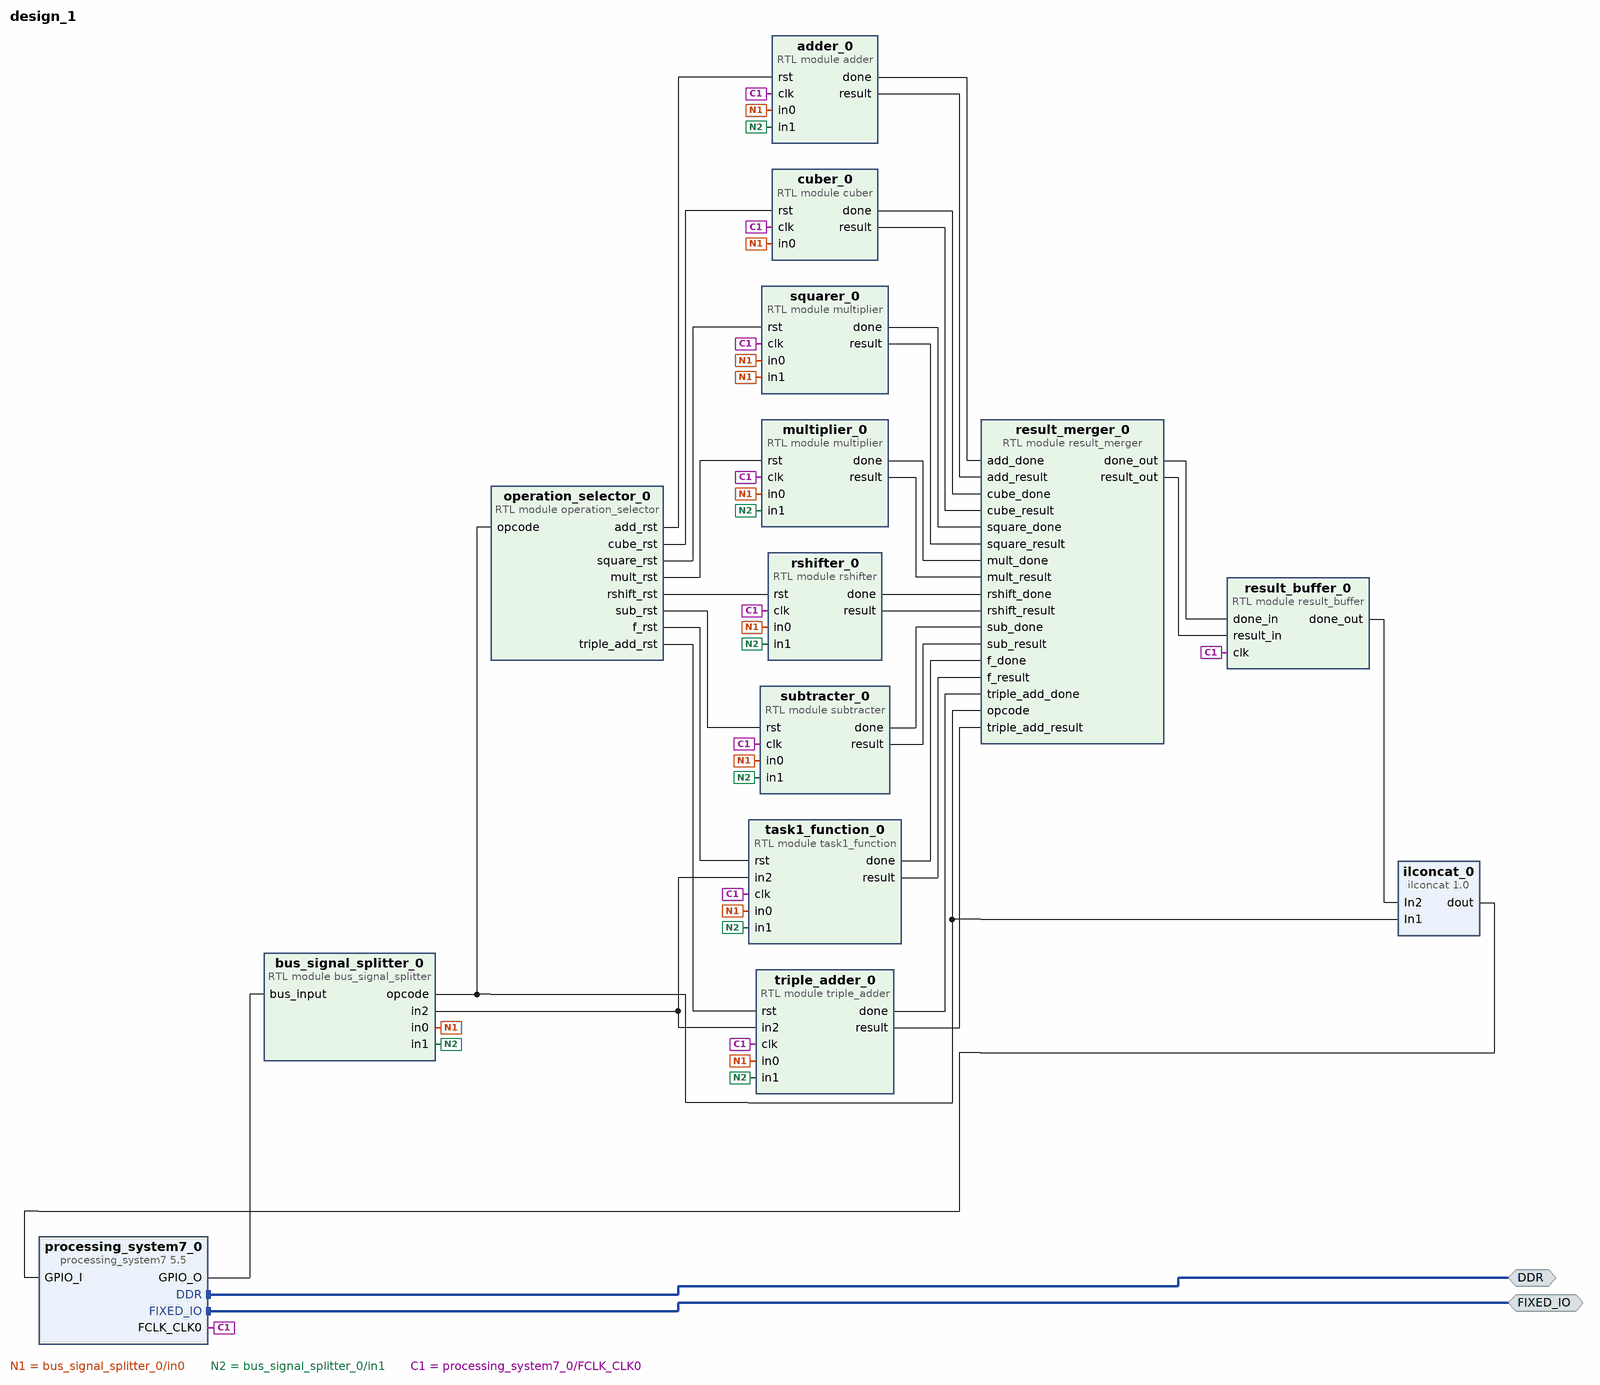
[diagram p0: block diagram of the top level]
# Vivado block design design_1, xc7z020clg400-1, Vivado 2025.2
create_bd_design design_1

create_bd_intf_port -mode Master -vlnv xilinx.com:interface:ddrx_rtl:1.0 DDR
create_bd_intf_port -mode Master -vlnv xilinx.com:display_processing_system7:fixedio_rtl:1.0 FIXED_IO

create_bd_cell -type ip -vlnv xilinx.com:ip:processing_system7:5.5 processing_system7_0
set_property -dict [list \
  CONFIG.PCW_GPIO_EMIO_GPIO_ENABLE 1 \
  CONFIG.PCW_GPIO_EMIO_GPIO_IO 52 \
  CONFIG.PCW_GPIO_EMIO_GPIO_WIDTH 52 \
  CONFIG.PCW_USE_M_AXI_GP0 0 \
] [get_bd_cells processing_system7_0]
# 2 more settings of processing_system7_0 are not shown: defaults, MIO pin electricals, DDR timing, and values the tool derives
create_bd_cell -type module -reference adder adder_0
create_bd_cell -type module -reference cuber cuber_0
create_bd_cell -type module -reference multiplier multiplier_0
create_bd_cell -type module -reference rshifter rshifter_0
create_bd_cell -type module -reference subtracter subtracter_0
create_bd_cell -type module -reference task1_function task1_function_0
create_bd_cell -type module -reference triple_adder triple_adder_0
create_bd_cell -type module -reference result_buffer result_buffer_0
create_bd_cell -type module -reference result_merger result_merger_0
create_bd_cell -type module -reference multiplier squarer_0
create_bd_cell -type inline_hdl -vlnv xilinx.com:inline_hdl:ilconcat:1.0 ilconcat_0
set_property -dict {CONFIG.IN0_WIDTH 24 CONFIG.IN1_WIDTH 24 CONFIG.NUM_PORTS 3} [get_bd_cells ilconcat_0]
create_bd_cell -type module -reference bus_signal_splitter bus_signal_splitter_0
create_bd_cell -type module -reference operation_selector operation_selector_0

# ---- connections ----

connect_bd_intf_net [get_bd_intf_ports DDR] [get_bd_intf_pins processing_system7_0/DDR]
connect_bd_intf_net [get_bd_intf_ports FIXED_IO] [get_bd_intf_pins processing_system7_0/FIXED_IO]
connect_bd_net [get_bd_pins bus_signal_splitter_0/in0] \
  [get_bd_pins squarer_0/in0] [get_bd_pins squarer_0/in1] [get_bd_pins subtracter_0/in0] [get_bd_pins multiplier_0/in0] \
  [get_bd_pins adder_0/in0] [get_bd_pins rshifter_0/in0] [get_bd_pins task1_function_0/in0] [get_bd_pins cuber_0/in0] \
  [get_bd_pins triple_adder_0/in0]
connect_bd_net [get_bd_pins adder_0/done] [get_bd_pins result_merger_0/add_done]
connect_bd_net [get_bd_pins adder_0/result] [get_bd_pins result_merger_0/add_result]
connect_bd_net [get_bd_pins bus_signal_splitter_0/in1] \
  [get_bd_pins multiplier_0/in1] [get_bd_pins subtracter_0/in1] [get_bd_pins adder_0/in1] [get_bd_pins rshifter_0/in1] \
  [get_bd_pins task1_function_0/in1] [get_bd_pins triple_adder_0/in1]
connect_bd_net [get_bd_pins bus_signal_splitter_0/in2] [get_bd_pins task1_function_0/in2] [get_bd_pins triple_adder_0/in2]
connect_bd_net [get_bd_pins bus_signal_splitter_0/opcode] \
  [get_bd_pins ilconcat_0/In1] [get_bd_pins operation_selector_0/opcode] [get_bd_pins result_merger_0/opcode]
connect_bd_net [get_bd_pins cuber_0/done] [get_bd_pins result_merger_0/cube_done]
connect_bd_net [get_bd_pins cuber_0/result] [get_bd_pins result_merger_0/cube_result]
connect_bd_net [get_bd_pins ilconcat_0/dout] [get_bd_pins processing_system7_0/GPIO_I]
connect_bd_net [get_bd_pins multiplier_0/done] [get_bd_pins result_merger_0/mult_done]
connect_bd_net [get_bd_pins multiplier_0/result] [get_bd_pins result_merger_0/mult_result]
connect_bd_net -net multiplier_1_done [get_bd_pins squarer_0/done] [get_bd_pins result_merger_0/square_done]
connect_bd_net -net multiplier_1_result [get_bd_pins squarer_0/result] [get_bd_pins result_merger_0/square_result]
connect_bd_net [get_bd_pins operation_selector_0/add_rst] [get_bd_pins adder_0/rst]
connect_bd_net [get_bd_pins operation_selector_0/cube_rst] [get_bd_pins cuber_0/rst]
connect_bd_net [get_bd_pins operation_selector_0/f_rst] [get_bd_pins task1_function_0/rst]
connect_bd_net [get_bd_pins operation_selector_0/mult_rst] [get_bd_pins multiplier_0/rst]
connect_bd_net [get_bd_pins operation_selector_0/rshift_rst] [get_bd_pins rshifter_0/rst]
connect_bd_net [get_bd_pins operation_selector_0/square_rst] [get_bd_pins squarer_0/rst]
connect_bd_net [get_bd_pins operation_selector_0/sub_rst] [get_bd_pins subtracter_0/rst]
connect_bd_net [get_bd_pins operation_selector_0/triple_add_rst] [get_bd_pins triple_adder_0/rst]
connect_bd_net [get_bd_pins processing_system7_0/FCLK_CLK0] \
  [get_bd_pins adder_0/clk] [get_bd_pins cuber_0/clk] [get_bd_pins multiplier_0/clk] [get_bd_pins rshifter_0/clk] \
  [get_bd_pins subtracter_0/clk] [get_bd_pins task1_function_0/clk] [get_bd_pins triple_adder_0/clk] \
  [get_bd_pins result_buffer_0/clk] [get_bd_pins squarer_0/clk]
connect_bd_net [get_bd_pins processing_system7_0/GPIO_O] [get_bd_pins bus_signal_splitter_0/bus_input]
connect_bd_net [get_bd_pins result_buffer_0/done_out] [get_bd_pins ilconcat_0/In2]
connect_bd_net -net result_merger_0_done [get_bd_pins result_merger_0/done_out] [get_bd_pins result_buffer_0/done_in]
connect_bd_net -net result_merger_0_result [get_bd_pins result_merger_0/result_out] [get_bd_pins result_buffer_0/result_in]
connect_bd_net [get_bd_pins rshifter_0/done] [get_bd_pins result_merger_0/rshift_done]
connect_bd_net [get_bd_pins rshifter_0/result] [get_bd_pins result_merger_0/rshift_result]
connect_bd_net [get_bd_pins subtracter_0/done] [get_bd_pins result_merger_0/sub_done]
connect_bd_net [get_bd_pins subtracter_0/result] [get_bd_pins result_merger_0/sub_result]
connect_bd_net [get_bd_pins task1_function_0/done] [get_bd_pins result_merger_0/f_done]
connect_bd_net [get_bd_pins task1_function_0/result] [get_bd_pins result_merger_0/f_result]
connect_bd_net [get_bd_pins triple_adder_0/done] [get_bd_pins result_merger_0/triple_add_done]
connect_bd_net [get_bd_pins triple_adder_0/result] [get_bd_pins result_merger_0/triple_add_result]

validate_bd_design
save_bd_design
